# EAGLE design working (EAGLE 7.1.0)
CNAME: ClockMeister 2100; CREVISION: B; DESIGNER: Ariejan de Vroom
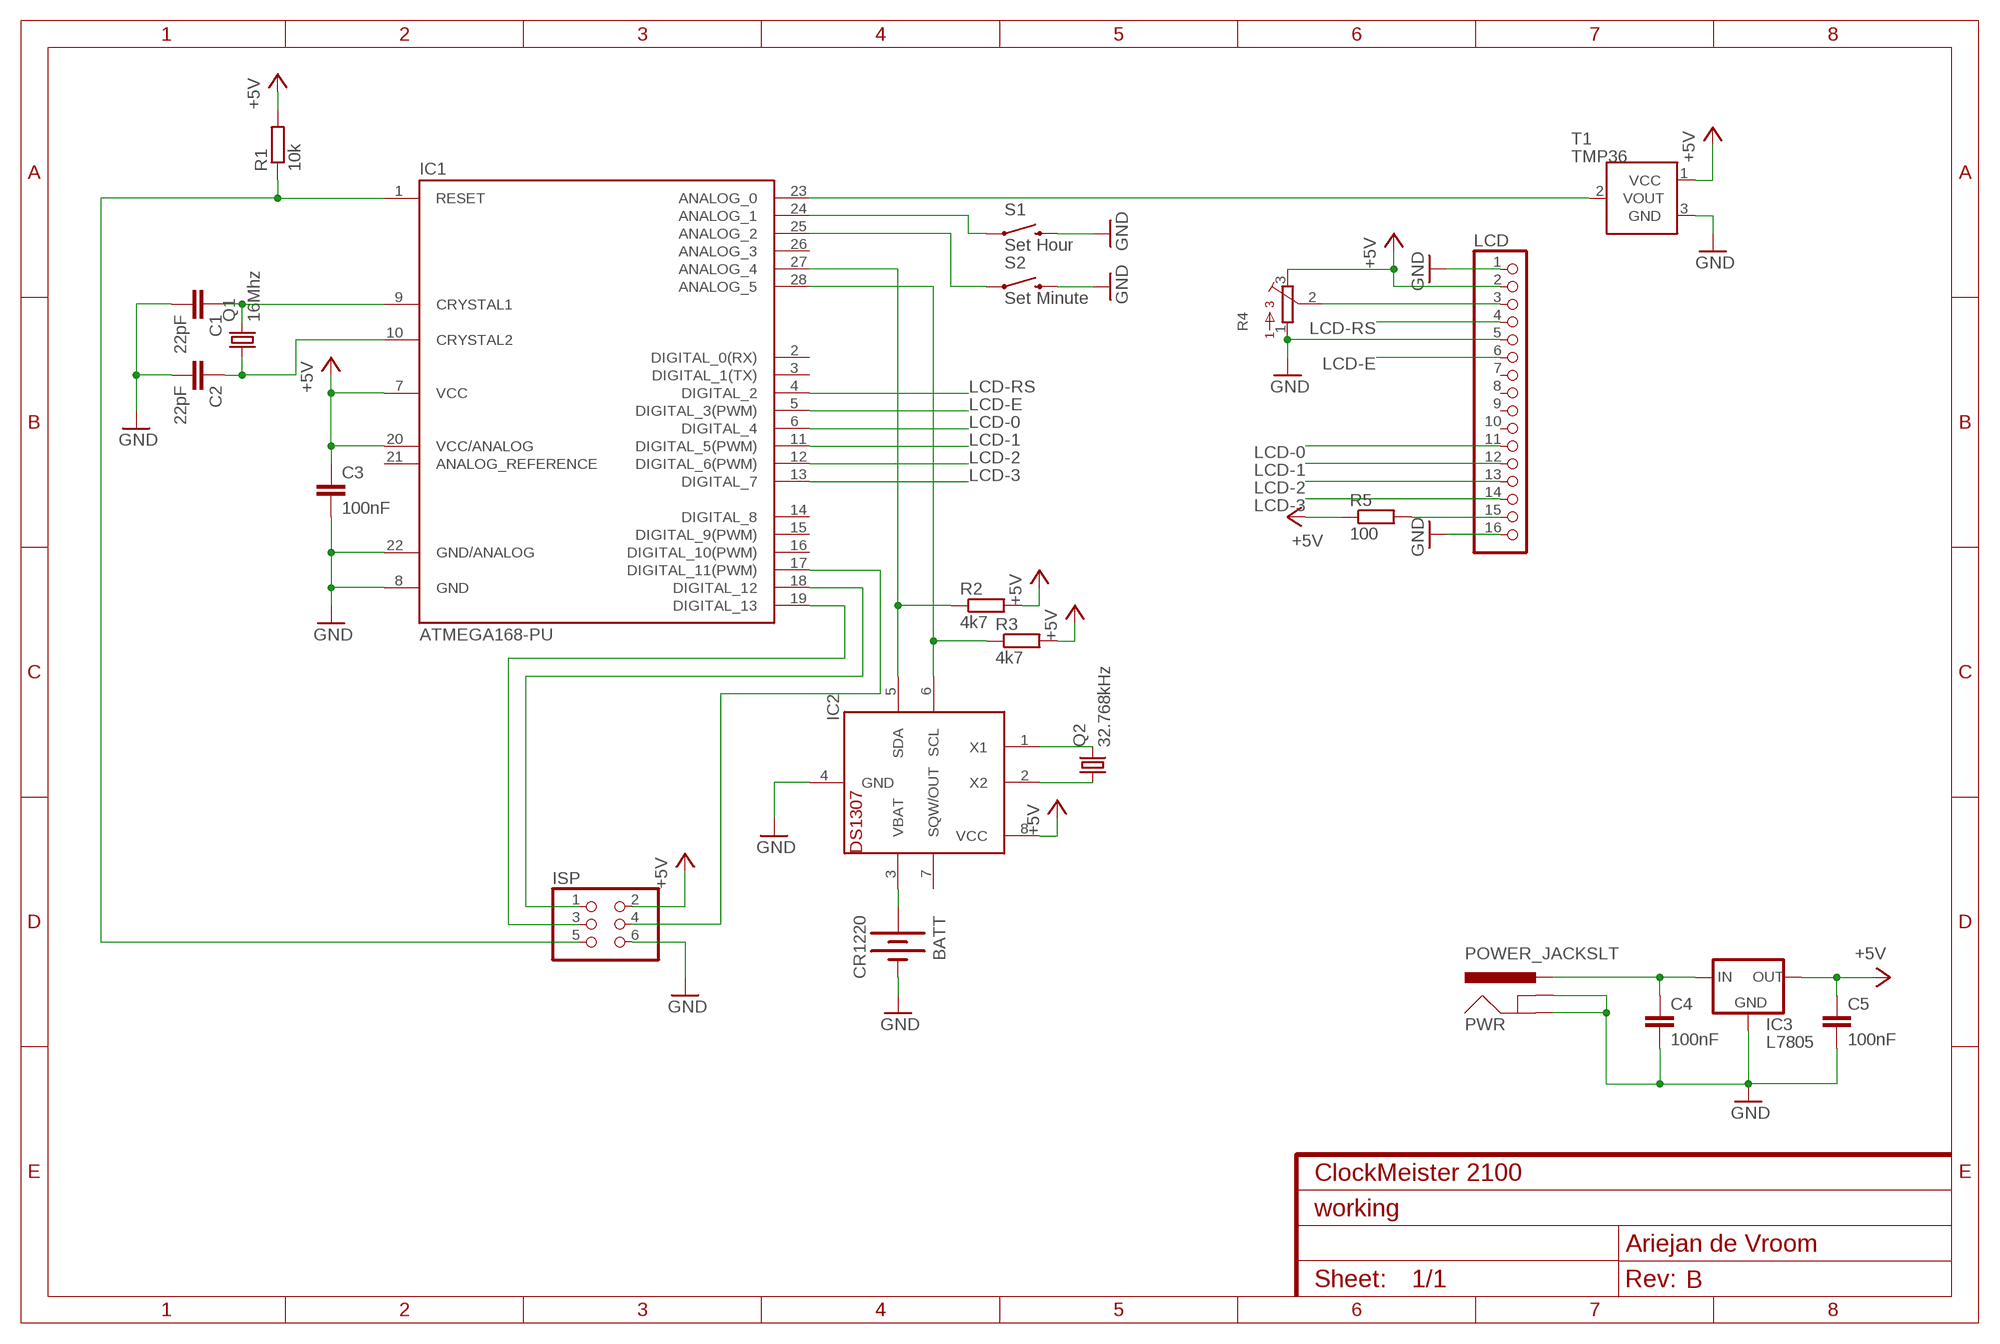
[diagram p0: schematic, sheet 1]

## Parts
BATT  CR1220  BATTERY12PTH  [BATTCON_12MM_PTH]
C1  22pF  C-EU025-025X050  [C025-025X050]
C2  22pF  C-EU025-025X050  [C025-025X050]
C3  100nF  C-EU025-025X050  [C025-025X050]
C4  100nF  C-EU025-025X050  [C025-025X050]
C5  100nF  C-EU025-025X050  [C025-025X050]
IC1  ATMEGA168-PU  [DIL28-3]
IC2  DS1307  [DIL08]
IC3  L7805  78XXS  [78XXS]
ISP  PINHD-2X3  [2X03]
LCD  PINHD-1X16  [1X16]
PWR  POWER_JACKSLT  [POWER_JACK_SLOT]
Q1  16Mhz  CRYSTALHC49S  [HC49/S]
Q2  32.768kHz  CRYSTALTC26H  [TC26H]
R1  10k  R-EU_0207/10  [0207/10]
R2  4k7  R-EU_0207/10  [0207/10]
R3  4k7  R-EU_0207/10  [0207/10]
R4  3386-F  [3386F]
R5  100  R-EU_0207/10  [0207/10]
S1  Set Hour  SWITCH-MOMENTARY-2PTH  [TACTILE-PTH]
S2  Set Minute  SWITCH-MOMENTARY-2PTH  [TACTILE-PTH]
T1  TMP36  [TO92]

## Nets
+5V: C3.1 C5.1 IC1.7(VCC) IC1.20(VCC/ANALOG) IC2.8(VCC) IC3.OUT ISP.2 LCD.2 R1.2 R2.2 R3.2 R4.3 R5.1 T1.1(VCC)
GND: BATT.GND(-) C1.2 C2.2 C3.2 C4.2 C5.2 IC1.8(GND) IC1.22(GND/ANALOG) IC2.4(GND) IC3.GND ISP.6 LCD.1 LCD.5 LCD.16 PWR.GND@1(GNDBREAK) PWR.GND@2(GND) R4.1 S1.3 S2.3 T1.3(GND)
LCD-0: IC1.6(DIGITAL_4) LCD.11
LCD-1: IC1.11(DIGITAL_5(PWM)) LCD.12
LCD-2: IC1.12(DIGITAL_6(PWM)) LCD.13
LCD-3: IC1.13(DIGITAL_7) LCD.14
LCD-E: IC1.5(DIGITAL_3(PWM)) LCD.6
LCD-RS: IC1.4(DIGITAL_2) LCD.4
N$1: LCD.15 R5.2
N$2: IC1.23(ANALOG_0) T1.2(VOUT)
N$4: IC1.24(ANALOG_1) S1.1
N$5: C2.1 IC1.10(CRYSTAL2) Q1.1
N$6: C1.1 IC1.9(CRYSTAL1) Q1.2
N$8: IC1.25(ANALOG_2) S2.1
N$9: C4.1 IC3.IN PWR.PWR
N$12: LCD.3 R4.2
N$17: IC1.28(ANALOG_5) IC2.6(SCL) R3.1
N$18: IC1.27(ANALOG_4) IC2.5(SDA) R2.1
N$19: IC2.1(X1) Q2.2
N$20: IC2.2(X2) Q2.1
N$21: BATT.VCC@1(+) IC2.3(VBAT)
N$22: IC1.1(RESET) ISP.5 R1.1
N$23: IC1.17(DIGITAL_11(PWM)) ISP.4
N$24: IC1.18(DIGITAL_12) ISP.1
N$25: IC1.19(DIGITAL_13) ISP.3
Unconnected: IC1.2(DIGITAL_0(RX)) IC1.3(DIGITAL_1(TX)) IC1.14(DIGITAL_8) IC1.15(DIGITAL_9(PWM)) IC1.16(DIGITAL_10(PWM)) IC1.21(ANALOG_REFERENCE) IC1.26(ANALOG_3) IC2.7(SQW/OUT) LCD.7 LCD.8 LCD.9 LCD.10

## Library data of the parts
BATT = SparkFun-Electromechanical:BATTERY: Battery Holders Various common sizes : AA, AAA, 20mm coin cell and 12mm coin cell. 20MM_4LEGS, BATT-10373; MF: KEYSTONE; MPN: 3001; OC_FARNELL: 908642
C1 C2 = rcl:C-EU: CAPACITOR, European symbol; MF: MULTICOMP; MPN: MCCHU5220J5; OC_FARNELL: 9411674
C3-C5 = rcl:C-EU: CAPACITOR, European symbol; MF: MULTICOMP; MPN: MCFYU6104Z6; OC_FARNELL: 9411887
IC1 = Arduino-AVR:ATMEGA168-PU; MF: ATMEL; MPN: ATMEGA328P-PU; OC_FARNELL: 1715487
IC2 = adafruit:DS1307: DS1307 Real time clock (RTC) with battery backup ability. Talk to it via i2c; MF: MAXIM INTEGRATED PRODUCTS; MPN: DS1307+.; OC_FARNELL: 1188042
IC3 = v-reg:78XXS: VOLTAGE REGULATOR; MF: STMICROELECTRONICS; MPN: L7805CV; OC_FARNELL: 9756078
ISP = pinhead:PINHD-2X3: PIN HEADER; MF: TE CONNECTIVITY / AMP; MPN: 826942-3; OC_FARNELL: 1248159
LCD = pinhead:PINHD-1X16: PIN HEADER; MF: SAMTEC; MPN: BBS-116-T-A; OC_FARNELL: 1766220
PWR = SparkFun-Connectors:POWER_JACK: Power Jack This is the standard 5.5mm barrel jack for power. The PTH is the most common, proven, reliable, footprint. The Slot footprint only works if the mill layer is transmitted to the PCB fab house so be warned. Mating wall wart : TOL-00298 (and others); OC_FARNELL: unknown; PROD_ID: PRT-00119
Q1 = crystal:CRYSTAL: CRYSTAL; MF: MULTICOMP; MPN: HC49SM-3.6864-30-50-60-16-ATF; OC_FARNELL: 1667008; OC_NEWARK: unknown
Q2 = crystal:CRYSTAL: CRYSTAL; MF: ABRACON; MPN: AB38T-32.768KHZ; OC_FARNELL: 1611828; OC_NEWARK: unknown
R1 = rcl:R-EU_: RESISTOR, European symbol; MF: MULTICOMP; MPN: MCCFR0W4J0103A50; OC_FARNELL: 1692465
R2 R3 = rcl:R-EU_: RESISTOR, European symbol; MF: MULTICOMP; MPN: MCF 0.5W 4K7; OC_FARNELL: 9338829
R4 = bourns:3386-: 3386 Series 3/8" Square Trimmer
R5 = rcl:R-EU_: RESISTOR, European symbol; MF: MULTICOMP; MPN: MCCFR0W4J0101A50; OC_FARNELL: 2368815
S1 S2 = SparkFun-Electromechanical:SWITCH-MOMENTARY-2: Various NO switches- pushbuttons, reed, etc; MF: OMRON ELECTRONIC COMPONENTS; MPN: B3F1120; OC_FARNELL: 1960953
T1 = ariejan:TMP36: TMP36 Easy to use temperature sensor

## Net classes
0 default: width 0.305 mm, drill 0.508 mm, clearance 0.254 mm

## Board
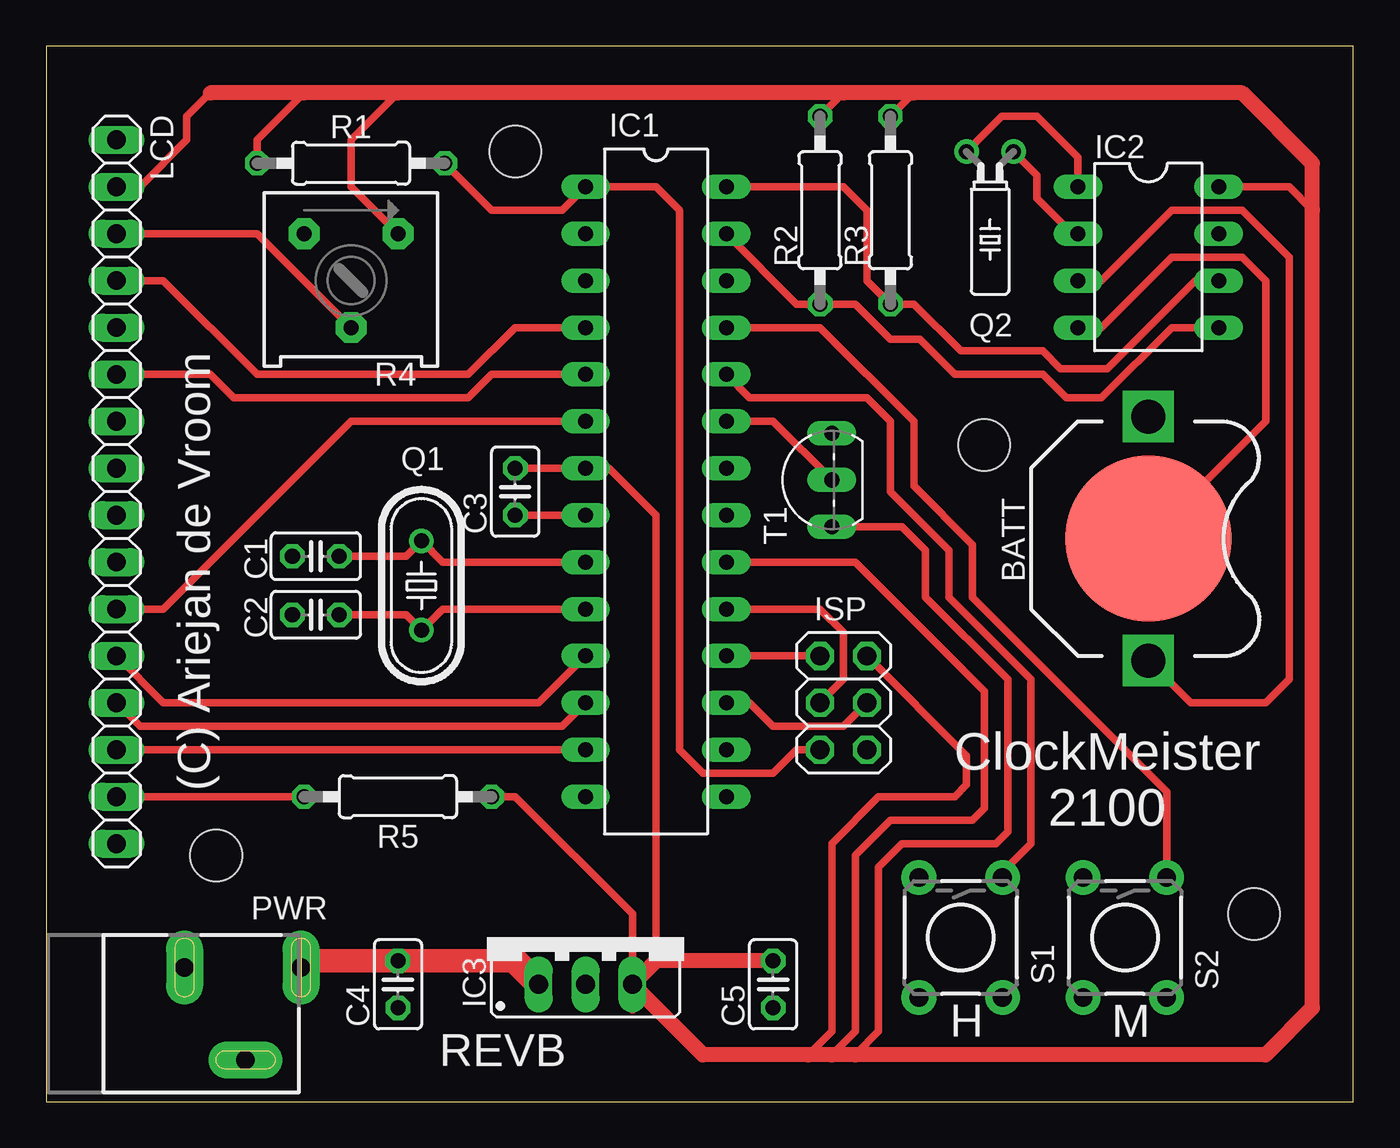
[diagram p1: board, top side]
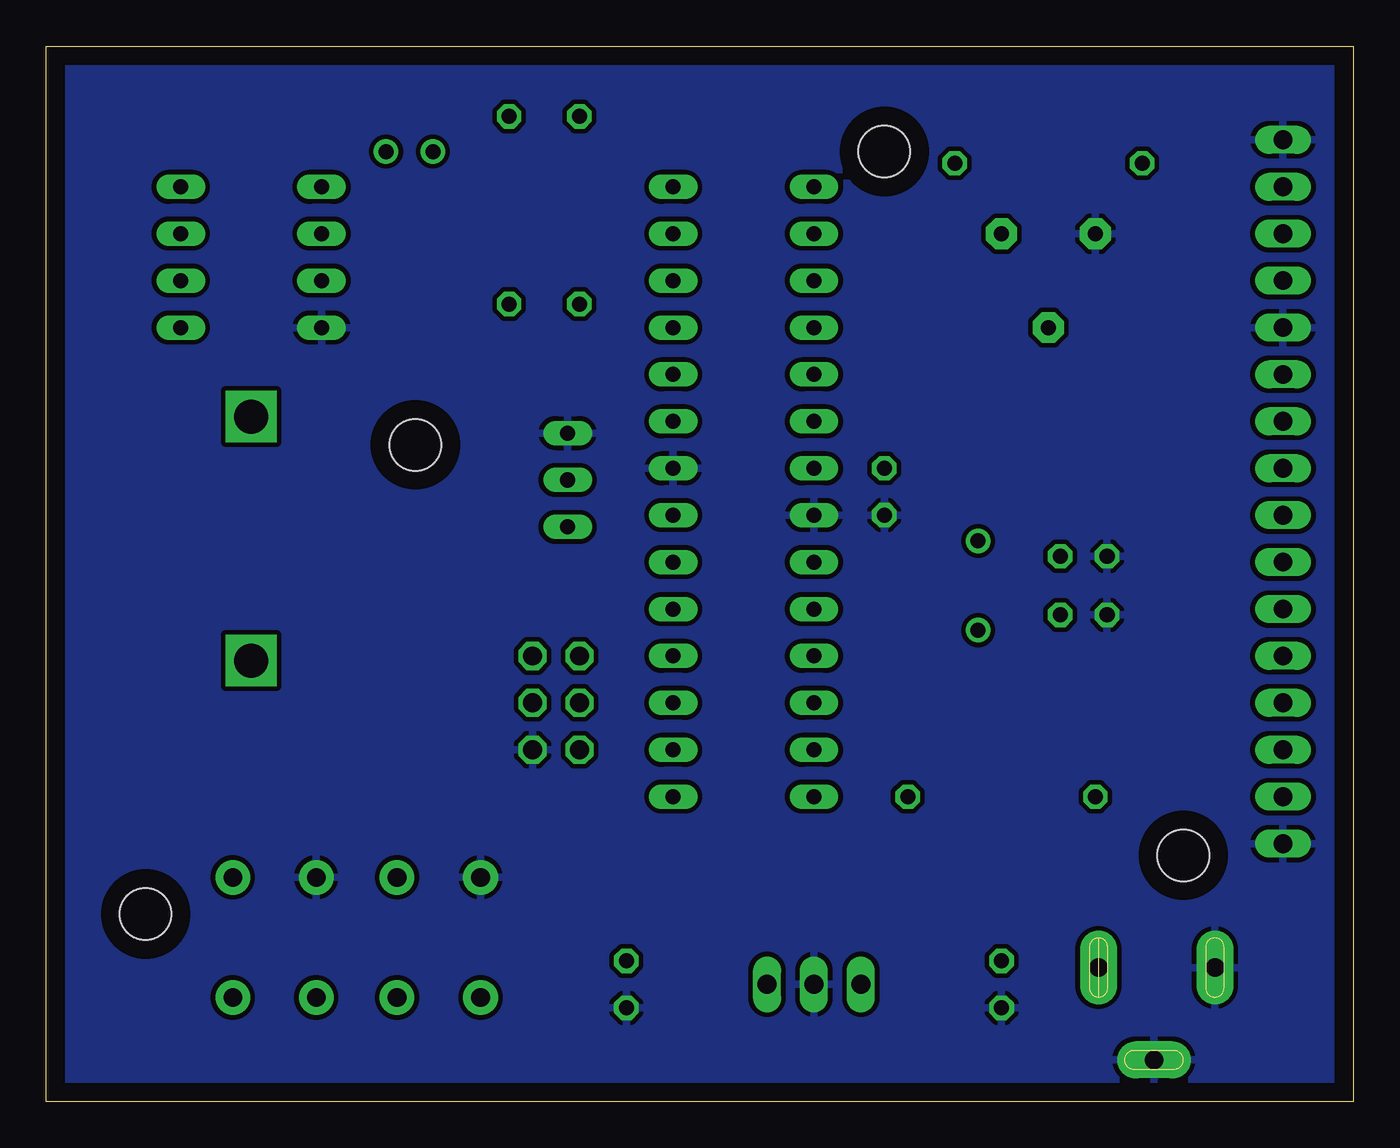
[diagram p2: board, bottom side, seen from below]

Size 70.79 x 57.14 mm. Coordinates in mm from the lower left corner, seen from the top.
Outline: 0,0 70.79,0 70.79,57.14 0,57.14 0,0
Copper layers (1*16): Top 0.035mm / dielectric 1.5mm / Bottom 0.035mm
Design rules "default": minimum track width 10mil, minimum drill 24mil, track to track 8mil, track to pad 8mil, pad to pad 8mil, via to via 8mil, smd to smd 8mil, copper to edge 40mil, drill to drill 8mil, minimum pad ring 10mil, minimum via ring 8mil, stop-mask expansion 4mil, vias tented up to drill 0mil, thermal gap 10mil
Holes 2.8 mm at 65.41,10.16 9.21,13.34 25.4,51.44 50.8,35.56

### Footprints (pad centres in the part's own frame; a part is rotated, then mirrored left to right if it is on the bottom)
BATTCON_12MM_PTH = smd 9 x 9: GND 0,0 | drill 1.854 square: VCC@1 6.604,0; VCC@2 -6.604,0
C025-025X050 = drill 0.813 octagon: 1 -1.27,0; 2 1.27,0
DIL28-3 = drill 0.813 long: 1 -16.51,-3.81; 2 -13.97,-3.81; 3 -11.43,-3.81; 4 -8.89,-3.81; 5 -6.35,-3.81; 6 -3.81,-3.81; 7 -1.27,-3.81; 8 1.27,-3.81; 9 3.81,-3.81; 10 6.35,-3.81; 11 8.89,-3.81; 12 11.43,-3.81; 13 13.97,-3.81; 14 16.51,-3.81; 15 16.51,3.81; 16 13.97,3.81; 17 11.43,3.81; 18 8.89,3.81; 19 6.35,3.81; 20 3.81,3.81; 21 1.27,3.81; 22 -1.27,3.81; 23 -3.81,3.81; 24 -6.35,3.81; 25 -8.89,3.81; 26 -11.43,3.81; 27 -13.97,3.81; 28 -16.51,3.81
DIL08 = drill 0.813 long: 1 -3.81,-3.81; 2 -1.27,-3.81; 3 1.27,-3.81; 4 3.81,-3.81; 5 3.81,3.81; 6 1.27,3.81; 7 -1.27,3.81; 8 -3.81,3.81
78XXS = drill 1.016 long: GND 0,-2.54; IN -2.54,-2.54; OUT 2.54,-2.54
2X03 = drill 1.016 octagon: 1 -2.54,-1.27; 2 -2.54,1.27; 3 0,-1.27; 4 0,1.27; 5 2.54,-1.27; 6 2.54,1.27
1X16 = drill 1.016 long: 1 -19.05,0; 2 -16.51,0; 3 -13.97,0; 4 -11.43,0; 5 -8.89,0; 6 -6.35,0; 7 -3.81,0; 8 -1.27,0; 9 1.27,0; 10 3.81,0; 11 6.35,0; 12 8.89,0; 13 11.43,0; 14 13.97,0; 15 16.51,0; 16 19.05,0
POWER_JACK_SLOT = drill 1 pad 2 long: GND@1 2.58,7.5; GND@2 7.58,10.8; PWR 2.58,13.8
HC49/S = drill 0.813: 1 -2.413,0; 2 2.413,0
TC26H = drill 0.813: 1 -1.27,0; 2 1.27,0
0207/10 = drill 0.813 octagon: 1 -5.08,0; 2 5.08,0
3386F = drill 0.813 pad 1.676 octagon: 1 -2.54,2.54; 2 0,-2.54; 3 2.54,2.54
TACTILE-PTH = drill 1.016 pad 1.88: 1 -3.251,2.261; 2 3.251,2.261; 3 -3.251,-2.261; 4 3.251,-2.261
TO92 = drill 0.813 long: 1 -2.54,0; 2 0,0; 3 2.54,0

### Placement (x,y rotation side)
BATT  59.69,30.48 270 top
C1  14.61,29.53 180 top
C2  14.61,26.35 180 top
C3  25.4,33.02 270 top
C4  19.05,6.35 270 top
C5  39.37,6.35 270 top
IC1  33.02,33.02 270 top
IC2  59.69,45.72 270 top
IC3  29.21,8.89 0 top
ISP  43.18,21.59 270 top
LCD  3.81,33.02 270 top
PWR  0,9.84 270 top
Q1  20.32,27.94 90 top
Q2  51.12,51.44 180 top
R1  16.51,50.8 180 top
R2  41.91,48.26 90 top
R3  45.72,48.26 90 top
R4  16.51,44.45 0 top
R5  19.05,16.51 180 top
S1  49.53,8.89 270 top
S2  58.42,8.89 270 top
T1  42.55,33.66 90 top

### Tracks (layer width: path | path; a pad name or v marks a point on that pad's centre or on a via)
+5V
  Top 0.406: IC3.OUT 31.75,10.16 25.4,16.51 R5.1 | IC2.8 67.31,49.53 68.58,48.26 | R1.2 11.43,52.07 13.97,54.61 | R2.2 43.18,54.61 | 33.02,7.62 33.02,31.75 30.48,34.29 IC1.7 C3.1 | LCD.2 5.08,49.53 7.62,52.07 7.62,53.34 8.89,54.61 | 43.81,2.54 45.09,3.81 45.09,12.7 46.35,13.97 51.44,13.97 52.07,14.61 52.07,22.86 47.62,27.3 47.62,29.84 46.35,31.11 T1.1 | IC1.20 43.81,29.21 50.8,22.23 50.8,15.88 50.16,15.24 45.72,15.24 43.81,13.34 43.81,3.81 42.55,2.54 | 41.27,2.54 42.55,3.81 42.55,13.97 45.09,16.51 49.21,16.51 49.85,17.14 49.85,18.73 ISP.2 | R3.2 46.99,54.61 | R4.3 16.51,49.53 16.51,52.07 19.05,54.61
  Top 0.61: IC3.OUT 31.75,5.08
  Top 0.813: 8.89,54.61 13.97,54.61 19.05,54.61 43.18,54.61 46.99,54.61 64.77,54.61 68.58,50.8 68.58,48.26 68.58,5.08 66.04,2.54 43.81,2.54 42.55,2.54 41.27,2.54 35.56,2.54 IC3.OUT 33.02,7.62 C5.1
GND
  Top 0.406: IC2.4 57.15,41.91 60.96,45.72 64.77,45.72 66.04,44.45 66.04,36.83 BATT.GND | C3.2 IC1.8
  pour Bottom: -2.54,58.42 72.39,58.42 72.39,-1.27 -1.27,-1.27 -2.54,-1.27
LCD-0
  Top 0.406: IC1.6 16.51,36.83 6.35,26.67 LCD.11
LCD-1
  Top 0.406: IC1.11 26.67,21.59 6.35,21.59 LCD.12
LCD-2
  Top 0.406: IC1.12 27.94,20.32 5.08,20.32 LCD.13
LCD-3
  Top 0.406: IC1.13 LCD.14
LCD-E
  Top 0.406: IC1.5 24.13,39.37 22.86,38.1 10.16,38.1 8.89,39.37 LCD.6
LCD-RS
  Top 0.406: IC1.4 25.4,41.91 22.86,39.37 11.43,39.37 6.35,44.45 LCD.4
N$1
  Top 0.406: R5.2 LCD.15
N$2
  Top 0.406: T1.2 39.37,36.83 IC1.23
N$4
  Top 0.406: S1.1 51.79,12.42 53.34,13.97 53.34,22.86 48.9,27.3 48.9,29.84 45.72,33.02 45.72,36.83 44.45,38.1 38.1,38.1 IC1.24
N$5
  Top 0.406: IC1.10 21.46,26.67 Q1.1 19.49,26.35 C2.1
N$6
  Top 0.406: IC1.9 21.46,29.21 Q1.2 19.49,29.53 C1.1
N$8
  Top 0.406: IC1.25 41.91,41.91 46.99,36.83 46.99,33.34 50.16,30.16 50.16,27.3 60.68,16.79 S2.1
N$9
  Top 1.27: 25.4,7.62 C4.1 14.47,7.62 PWR.PWR
  Top 1.422: 25.4,7.62 IC3.IN
N$12
  Top 0.406: R4.2 11.43,46.99 LCD.3
N$17
  Top 0.406: IC1.28 43.18,49.53 44.45,48.26 44.45,44.45 R3.1 46.99,43.18 49.53,40.64 53.98,40.64 54.93,39.69 57.47,39.69 62.23,44.45 IC2.6
N$18
  Top 0.406: IC1.27 40.64,43.18 R2.1 43.81,43.18 45.72,41.27 47.31,41.27 49.21,39.37 53.98,39.37 55.24,38.1 57.15,38.1 60.96,41.91 IC2.5
N$19
  Top 0.406: IC2.1 55.88,51.12 53.66,53.34 51.75,53.34 Q2.2
N$20
  Top 0.406: IC2.2 55.56,46.99 53.66,48.9 53.66,50.16 Q2.1
N$21
  Top 0.406: IC2.3 57.15,44.45 60.96,48.26 64.77,48.26 67.31,45.72 67.31,22.86 66.04,21.59 61.98,21.59 BATT.VCC@1
N$22
  Top 0.406: R1.1 24.13,48.26 27.94,48.26 IC1.1 33.02,49.53 34.29,48.26 34.29,19.05 35.56,17.78 39.37,17.78 40.64,19.05 ISP.5
N$23
  Top 0.406: IC1.17 38.1,21.59 39.37,20.32 43.18,20.32 ISP.4
N$24
  Top 0.406: ISP.1 IC1.18
N$25
  Top 0.406: ISP.3 43.18,22.86 43.18,25.4 41.91,26.67 IC1.19

### Text on the board
tPlace: (C) Ariejan de Vroom | ClockMeister / 2100 | H | M | REVB